# EAGLE design rn2xx3 (EAGLE 9.1.0)
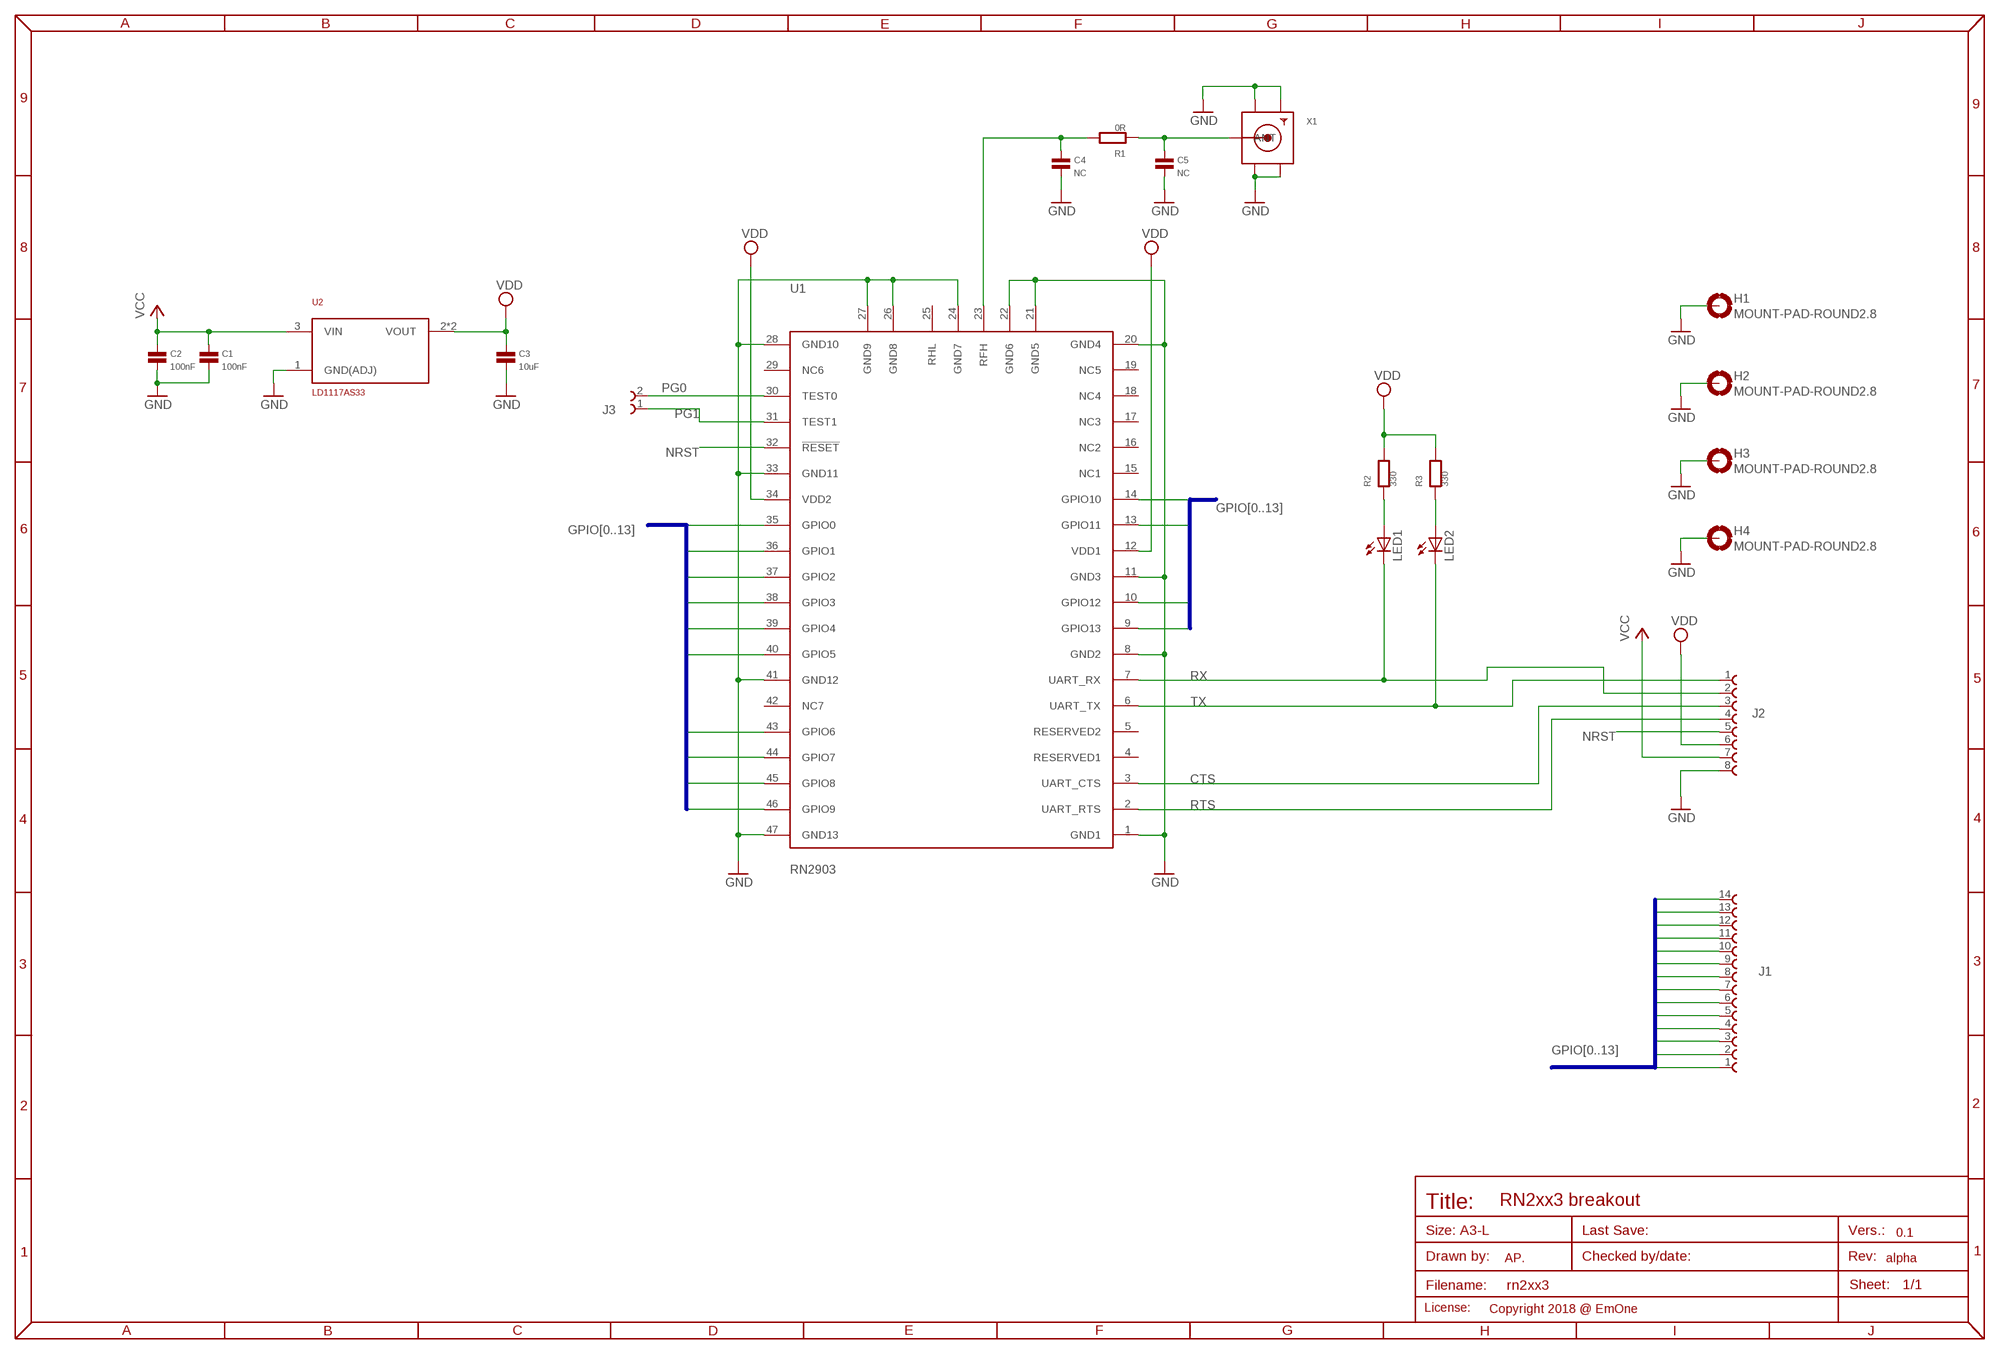
[diagram p0: schematic, sheet 1]
A3L1 (A3L-MPAD): AUTHOR: AP.; LICENSE: Copyright 2018 @ EmOne; REVISION: alpha; VERSION: 0.1

## Parts
C1  100nF  C0603  [0603]
C2  100nF  C0603  [0603]
C3  10uF  C0603  [0603]
C4  NC  C0402  [0402]
C5  NC  C0402  [0402]
H1  MOUNT-PAD-ROUND2.8  [2,8-PAD]
H2  MOUNT-PAD-ROUND2.8  [2,8-PAD]
H3  MOUNT-PAD-ROUND2.8  [2,8-PAD]
H4  MOUNT-PAD-ROUND2.8  [2,8-PAD]
J1  61301411121  [61301411121]
J2  61300811021  [61300811021]
J3  61300211121  [61300211121]
LED1  LED0603  [0603-LED]
LED2  LED0603  [0603-LED]
R1  0R  R0402  [0402]
R2  330  R0603  [0603]
R3  330  R0603  [0603]
U1  RN2903  RN2483/RN2903  [RN2483/RN2903]
U2  LD1117AS33  [SOT-223]
X1  SMACONNECTOR_EDGE_UFL  [SMA_EDGELAUNCH_UFL]

## Nets
CTS: J2.3 U1.3(UART_CTS)
GND: C1.2 C2.2 C3.2 C4.2 C5.2 H1.B2,8(MOUNT) H2.B2,8(MOUNT) H3.B2,8(MOUNT) H4.B2,8(MOUNT) J2.8 U1.1(GND1) U1.8(GND2) U1.11(GND3) U1.20(GND4) U1.21(GND5) U1.22(GND6) U1.24(GND7) U1.26(GND8) U1.27(GND9) U1.28(GND10) U1.33(GND11) U1.41(GND12) U1.47(GND13) U2.1(GND(ADJ)) X1.GND@1(GND1) X1.GND@2(GND2) X1.GND@3(GND3) X1.GND@4(GND4)
GPIO0: J1.1 U1.35(GPIO0)
GPIO1: J1.2 U1.36(GPIO1)
GPIO2: J1.3 U1.37(GPIO2)
GPIO3: J1.4 U1.38(GPIO3)
GPIO4: J1.5 U1.39(GPIO4)
GPIO5: J1.6 U1.40(GPIO5)
GPIO6: J1.7 U1.43(GPIO6)
GPIO7: J1.8 U1.44(GPIO7)
GPIO8: J1.9 U1.45(GPIO8)
GPIO9: J1.10 U1.46(GPIO9)
GPIO10: J1.11 U1.14(GPIO10)
GPIO11: J1.12 U1.13(GPIO11)
GPIO12: J1.13 U1.10(GPIO12)
GPIO13: J1.14 U1.9(GPIO13)
N$1: C4.1 R1.2 U1.23(RFH)
N$2: C5.1 R1.1 X1.P(ANT)
N$3: LED1.A R2.1
N$4: LED2.A R3.1
NRST: J2.5 U1.32(!RESET)
PG0: J3.2 U1.30(TEST0)
PG1: J3.1 U1.31(TEST1)
RTS: J2.4 U1.2(UART_RTS)
RX: J2.2 LED1.C U1.7(UART_RX)
TX: J2.1 LED2.C U1.6(UART_TX)
VCC: C1.1 C2.1 J2.7 U2.3(VIN)
VDD: C3.1 J2.6 R2.2 R3.2 U1.12(VDD1) U1.34(VDD2) U2.2(VOUT) U2.4(VOUT)
Unconnected: U1.4(RESERVED1) U1.5(RESERVED2) U1.15(NC1) U1.16(NC2) U1.17(NC3) U1.18(NC4) U1.19(NC5) U1.25(RHL) U1.29(NC6) U1.42(NC7)

## Buses
GPIO[0..13]

## Library data of the parts
C1-C5 = mbed-HDK:C: Capacitor
H1-H4 = holes:MOUNT-PAD-ROUND: MOUNTING PAD, round
J1 = Wurth_Elektronik_Electromechanic_Board_to_Board_Connectors_rev16c:61301411121: WR-PHD 2.54mm Pin Header, 14 Pins =>Code : Con_BTB_PHD_2.54_1_THT_61301411121 <http://katalog.we-online.de/media/images/eican/Con_BTB_PHD_2.54_1_THT_6130xx11121_pf2.jpg> Details see: http://katalog.we-online.de/en/em/613_0xx_111_21 Created 2014-05-29, Karrer Zheng 2014 (C) Würth Elektronik
J2 = Wurth_Elektronik_Electromechanic_Board_to_Board_Connectors_rev16c:61300811021: WR-PHD 2.54mm Angled Pin Header, 8 Pins =>Con_BTB_PHD_2.54_1_THT_61300811021 <http://katalog.we-online.de/media/images/eican/Con_BTB_PHD_2.54_1_THT_61303211021_pf2.jpg> Details see: http://katalog.we-online.de/en/em/613_0xx_110_21 Created 2014-05-29, Karrer Zheng 2014 (C) Würth Elektronik
J3 = Wurth_Elektronik_Electromechanic_Board_to_Board_Connectors_rev16c:61300211121: WR-PHD 2.54mm Pin Header, 2 Pin=>Code : Con_BTB_PHD_2.54_1_THT_61300211121 <http://katalog.we-online.de/media/images/eican/Con_BTB_PHD_2.54_1_THT_6130xx11121_pf2.jpg> Details see: http://katalog.we-online.de/en/em/613_0xx_111_21 Created 2014-05-29, Karrer Zheng 2014 (C) Würth Elektronik
LED1 LED2 = pixhawk2:LED: LEDs Standard schematic elements and footprints for 5mm, 3mm, 1206, and 0603 sized LEDs. 5mm - Spark Fun Electronics SKU : COM-00529 (and others)
R1-R3 = mbed-HDK:R
U1 = SyncChannelCustom:RN2483/RN2903: MicroChip RN2483/RN2903 LoRaWAN Module Digikey Part Numbers: - RN2903-I/RM095-ND - RN2483-I/RM101-ND
U2 = pixhawk2:LD1117A: LD1117A LDO Datasheet: http://www.st.com/stonline/books/pdf/docs/7194.pdf
X1 = adafruit:SMACONNECTOR: SMA Connector 90° DIP SMA Connector, 50 Ohm (4UConnector: 07259)

## Net classes
0 default: clearance 0.205 mm

## Board
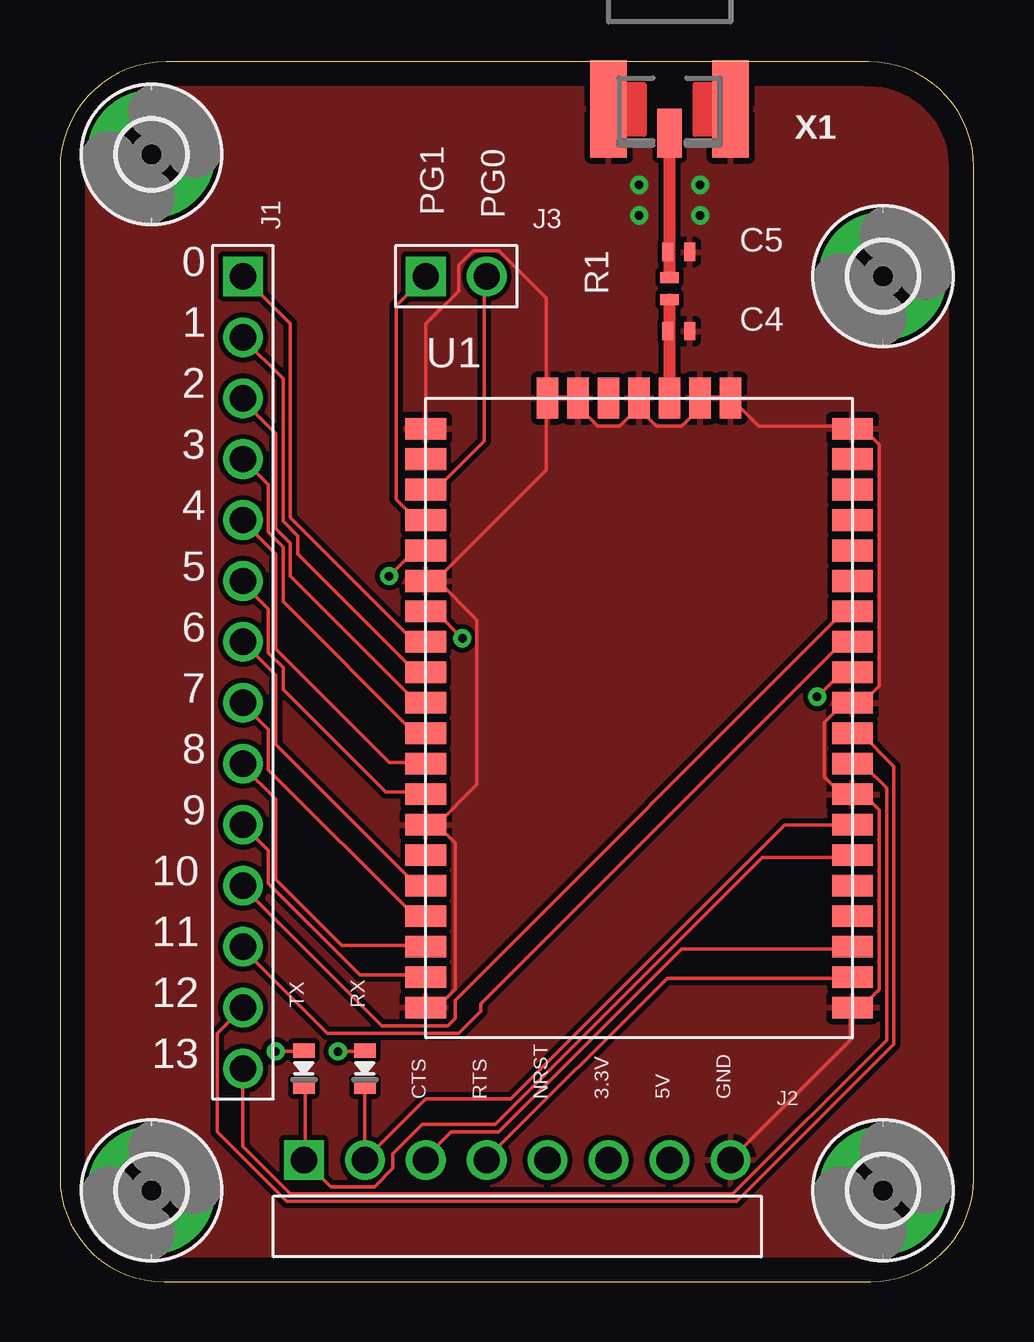
[diagram p1: board, top side]
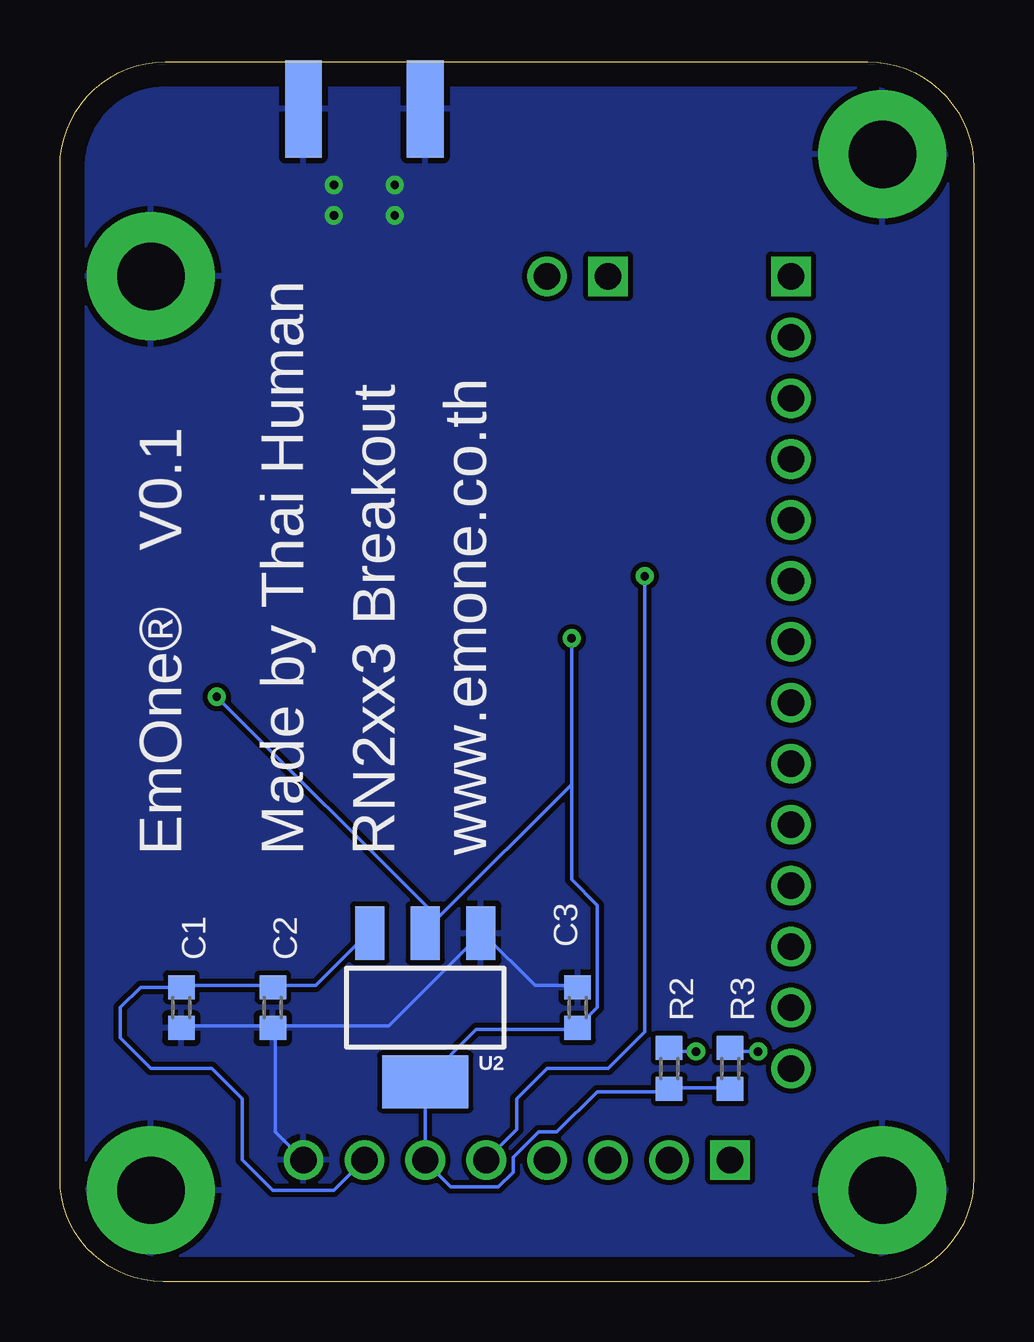
[diagram p2: board, bottom side, seen from below]

Size 38.08 x 50.85 mm. Coordinates in mm from the lower left corner, seen from the top.
Outline: 0,46.43 0,4.34 arc90 4.34,0 33.78,0 arc90 38.08,4.3 38.08,46.46 arc90 33.69,50.85 4.42,50.85 arc90 0,46.43
Copper layers (1*16): Top 0.035mm / dielectric 1.6mm / Bottom 0.035mm
Design rules "default *": minimum track width 6mil, minimum drill 0.35mm, track to track 6mil, track to pad 6mil, pad to pad 6mil, via to via 6mil, smd to smd 6mil, copper to edge 40mil, drill to drill 6mil, minimum pad ring 10mil, minimum via ring 8mil, stop-mask expansion 4mil, vias tented up to drill 0mil, thermal gap 10mil

### Footprints (pad centres in the part's own frame; a part is rotated, then mirrored left to right if it is on the bottom)
0603 = smd 1 x 1.1: 1 -0.85,0; 2 0.85,0
0402 = smd 0.457 x 0.762: 1 -0.457,0; 2 0.457,0
2,8-PAD = drill 2.8 pad 5.334: B2,8 0,0
61301411121 = drill 1.1 square: 1 -16.51,0 | drill 1.1: 2 -13.97,0; 3 -11.43,0; 4 -8.89,0; 5 -6.35,0; 6 -3.81,0; 7 -1.27,0; 8 1.27,0; 9 3.81,0; 10 6.35,0; 11 8.89,0; 12 11.43,0; 13 13.97,0; 14 16.51,0
61300811021 = drill 1.1 square: 1 8.89,0 | drill 1.1: 2 6.35,0; 3 3.81,0; 4 1.27,0; 5 -1.27,0; 6 -3.81,0; 7 -6.35,0; 8 -8.89,0
61300211121 = drill 1.1 square: 1 -1.27,0 | drill 1.1: 2 1.27,0
0603-LED = smd 0.6 x 0.9: A 0.75,0; C -0.75,0
RN2483/RN2903 = smd 1.7 x 0.9: 1 17.78,1.27; 2 17.78,2.54; 3 17.78,3.81; 4 17.78,5.08; 5 17.78,6.35; 6 17.78,7.62; 7 17.78,8.89; 8 17.78,10.16; 9 17.78,11.43; 10 17.78,12.7; 11 17.78,13.97; 12 17.78,15.24; 13 17.78,16.51; 14 17.78,17.78; 15 17.78,19.05; 16 17.78,20.32; 17 17.78,21.59; 18 17.78,22.86; 19 17.78,24.13; 20 17.78,25.4; 28 0,25.4; 29 0,24.13; 30 0,22.86; 31 0,21.59; 32 0,20.32; 33 0,19.05; 34 0,17.78; 35 0,16.51; 36 0,15.24; 37 0,13.97; 38 0,12.7; 39 0,11.43; 40 0,10.16; 41 0,8.89; 42 0,7.62; 43 0,6.35; 44 0,5.08; 45 0,3.81; 46 0,2.54; 47 0,1.27 | smd 0.9 x 1.7: 21 12.7,26.67; 22 11.43,26.67; 23 10.16,26.67; 24 8.89,26.67; 25 7.62,26.67; 26 6.35,26.67; 27 5.08,26.67
SOT-223 = smd 1.219 x 2.235: 1 -2.311,-3.099; 2 0,-3.099; 3 2.311,-3.099 | smd 3.6 x 2.2: 4 0,3.099
SMA_EDGELAUNCH_UFL = smd 4.064 x 1.524: GND@1 2.032,-2.54; GND@2 2.032,2.54 | smd 4.064 x 1.524 bottom: GND@3 2.032,2.54; GND@4 2.032,-2.54 | smd 2.032 x 1.016: P 3.048,0

### Placement (x,y rotation side)
C1  33.02,11.43 270 bottom
C2  29.21,11.43 270 bottom
C3  16.51,11.43 90 bottom
C4  25.78,39.62 0 top
C5  25.78,42.93 0 top
DRILEGEND  [DRILEGEND]  -0.08,-10.91 0 top  (outside the outline)
H1  34.29,3.81 0 top
H2  34.29,41.91 0 top
H3  3.81,46.99 0 top
H4  3.81,3.81 0 top
J1  7.62,25.4 270 top
J2  19.05,5.08 180 top
J3  16.51,41.91 0 top
LED1  12.7,8.89 90 top
LED2  10.16,8.89 90 top
R1  25.4,41.4 270 top
R2  12.7,8.89 270 bottom
R3  10.16,8.89 270 bottom
U1  15.24,10.16 0 top
U2  22.86,11.43 180 bottom
X1  25.4,50.93 270 top

### Tracks (layer width: path | path; a pad name or v marks a point on that pad's centre or on a via)
CTS
  Top 0.152: U1.3 32.92,13.87 25.91,13.87 18.29,6.25 16.31,6.25 15.24,5.18 J2.3
GND  (via drill 0.35)
  Top 0.152: J2.8 32.92,10.06 32.92,11.43 U1.1 33.38,11.43 34.14,12.19 34.14,19.66 33.53,20.27 33.07,20.27 U1.8 32.92,20.42 32.46,20.42 31.85,21.03 31.85,23.32 32.61,24.08 32.92,24.08 U1.11 33.07,24.23 33.53,24.23 34.14,24.84 34.14,34.9 33.53,35.51 33.07,35.51 U1.20 32.92,35.66 29.11,35.66 U1.21 27.89,36.88 26.67,36.88 U1.22 26.67,36.42 25.91,35.66 24.84,35.66 24.08,36.42 | U1.47 15.7,11.43 16.46,12.19 16.46,18.29 15.7,19.05 | 15.7,29.26 15.24,29.26 U1.33 15.7,29.26 | 15.7,29.26 20.27,33.83 20.27,36.73 U1.27 | U1.28 15.24,39.93 16.61,41.3 16.61,42.37 17.22,42.98 18.29,42.98 20.27,41 20.27,36.88 U1.27 | U1.27 20.42,36.88 21.49,36.88 U1.26 21.64,36.73 21.64,36.42 22.4,35.66 23.32,35.66 24.08,36.42 | 24.08,36.42 24.08,36.73 U1.24 24.08,36.42 | 15.7,19.05 17.37,20.73 17.37,27.58 15.7,29.26 | 15.7,19.05 U1.41
  Bottom 0.152: C3.2 16.61,12.34 18.29,12.34 20.42,14.48 U2.1 20.57,14.48 24.38,10.67 29.11,10.67 C2.2 | C2.2 29.26,10.67 32.92,10.67 C1.2 | J2.8 29.11,6.25 29.11,10.52 C2.2
  other vias: 24.13,45.72 24.13,44.45 26.67,45.72 26.67,44.45
  pour Top: 0,0 38.1,0 38.1,50.8 0,50.8
  pour Bottom: 0,0 38.1,0 38.1,50.8 0,50.8
GPIO0
  Top 0.152: U1.35 14.78,26.67 9.6,31.85 9.6,39.93 J1.1
GPIO1
  Top 0.152: U1.36 15.24,25.45 14.78,25.45 9.91,30.33 9.91,31.09 9.3,31.7 9.3,37.64 7.62,39.32 J1.2
GPIO2
  Top 0.152: U1.37 15.24,24.23 14.78,24.23 9.6,29.41 9.6,30.79 8.99,31.39 8.99,35.36 7.62,36.73 J1.3
GPIO3
  Top 0.152: U1.38 14.78,22.86 9.3,28.35 9.3,30.63 8.69,31.24 8.69,33.22 J1.4
GPIO4
  Top 0.152: U1.39 15.24,21.64 13.72,21.64 8.99,26.36 8.99,30.33 7.62,31.7 J1.5
GPIO5
  Top 0.152: U1.40 15.24,20.42 13.56,20.42 9.3,24.69 9.3,25.6 8.69,26.21 8.69,28.04 7.62,29.11 J1.6
GPIO6
  Top 0.152: J1.7 8.99,25.3 8.99,22.4 14.78,16.61 15.24,16.61 U1.43
GPIO7
  Top 0.152: U1.44 14.78,15.24 8.69,21.34 8.69,23.01 7.62,24.08 J1.8
GPIO8
  Top 0.152: U1.45 15.24,14.02 11.73,14.02 8.99,16.76 8.99,20.12 7.62,21.49 J1.9
GPIO9
  Top 0.152: J1.10 8.69,17.98 8.69,16.61 12.5,12.8 15.24,12.8 U1.46
GPIO10
  Top 0.152: U1.14 32.92,27.89 32.61,27.89 16.46,11.73 16.46,10.97 16.15,10.67 13.41,10.67 7.62,16.46 J1.11
GPIO11
  Top 0.152: U1.13 32.61,26.67 17.53,11.58 17.53,11.28 16.61,10.36 11.12,10.36 7.62,13.87 J1.12
GPIO12
  Top 0.152: U1.10 33.38,22.86 34.75,21.49 34.75,9.91 28.19,3.35 9.45,3.35 6.55,6.25 6.55,10.36 J1.13
GPIO13
  Top 0.152: J1.14 7.62,5.64 9.6,3.66 28.04,3.66 34.44,10.06 34.44,20.57 33.53,21.49 33.07,21.49 U1.9
N$1
  Top 0.152: 25.4,39.55 C4.1 arc90 25.4,39.7 | 25.32,40.87 R1.2
  Top 0.508: U1.23 25.4,39.55 | 25.4,39.7 R1.2
N$2
  Top 0.152: 25.4,42.85 C5.1 arc90 25.4,43 | 25.32,47.7 X1.P 25.4,48.26
  Top 0.508: R1.1 25.4,42.85 | 25.4,43 X1.P
N$3  (via drill 0.35)
  Top 0.152: v11.58,9.6 12.65,9.6 LED1.A
  Bottom 0.152: v11.58,9.6 12.65,9.6 R2.1
N$4  (via drill 0.35)
  Top 0.152: v8.99,9.6 10.06,9.6 LED2.A
  Bottom 0.152: v8.99,9.6 10.06,9.6 R3.1
NRST  (via drill 0.35)
  Top 0.152: U1.32 14.78,30.48 v13.72,29.41
  Bottom 0.152: 20.27,5.18 J2.5 19.05,6.35 19.05,7.62 17.78,8.89 15.24,8.89 13.72,10.41 v13.72,29.41
PG0
  Top 0.152: U1.30 15.24,33.07 15.7,33.07 17.68,35.05 17.68,41.91 J3.2
PG1
  Top 0.152: J3.1 14.02,40.69 14.02,32.61 14.78,31.85 15.24,31.85 U1.31
RTS
  Top 0.152: U1.2 32.92,12.65 25.3,12.65 17.83,5.18 J2.4
RX
  Top 0.152: 12.8,8.08 LED1.C J2.2 15.24,7.62 18.77,7.62 30.2,19.05 U1.7
  Bottom 0.152: 12.65,5.18 J2.2
TX
  Top 0.152: U1.6 32.92,17.68 29.26,17.68 18.14,6.55 15.09,6.55 13.87,5.33 13.87,4.72 13.11,3.96 11.28,3.96 J2.1 10.21,5.18 10.21,8.08 LED2.C
VCC
  Bottom 0.152: C1.1 32.92,12.34 29.26,12.34 C2.1 29.11,12.34 27.43,12.34 25.3,14.48 U2.3 | 33.07,12.19 C1.1 | 25.45,5.03 J2.7 26.67,3.81 29.21,3.81 30.48,5.08 30.48,7.62 31.75,8.89 34.29,8.89 35.56,10.16 35.56,11.43 34.71,12.28 C1.1
VDD  (via drill 0.35)
  Top 0.152: v31.55,24.38 32.46,25.3 32.92,25.3 U1.12 | v16.76,26.82 15.7,27.89 15.24,27.89 U1.34
  Bottom 0.152: 16.76,20.73 v16.76,26.82 | 22.25,15.24 22.86,14.63 U2.2 | 22.25,15.24 16.76,20.73 | 16.76,20.73 16.76,16.76 15.7,15.7 15.7,11.43 16.46,10.67 C3.1 16.61,10.52 20.73,10.52 22.86,8.38 U2.4 J2.6 22.86,5.03 21.79,3.96 19.81,3.96 19.2,4.57 19.2,5.18 18.14,6.25 17.37,6.25 15.7,7.92 12.8,7.92 R2.2 12.65,8.08 10.21,8.08 R3.2 | v31.55,24.38 22.4,15.24 22.25,15.24

### Text on the board
tNames: PG1 | PG0 | 0 | 1 | 2 | 3 | 4 | 5 | 6 | 7 | 8 | 9 | 10 | 11 | 12 | TX | RX | 13 | CTS | RTS | NRST | 3.3V | 5V | GND
bNames: V0.1 | www.emone.co.th | RN2xx3 Breakout | Made by Thai Human | EmOne®
DrillLegend: LAYER-STACK
DrillLegend_01-16: 01-16